# Altium project CC Programmer and Debugger.PrjPcb
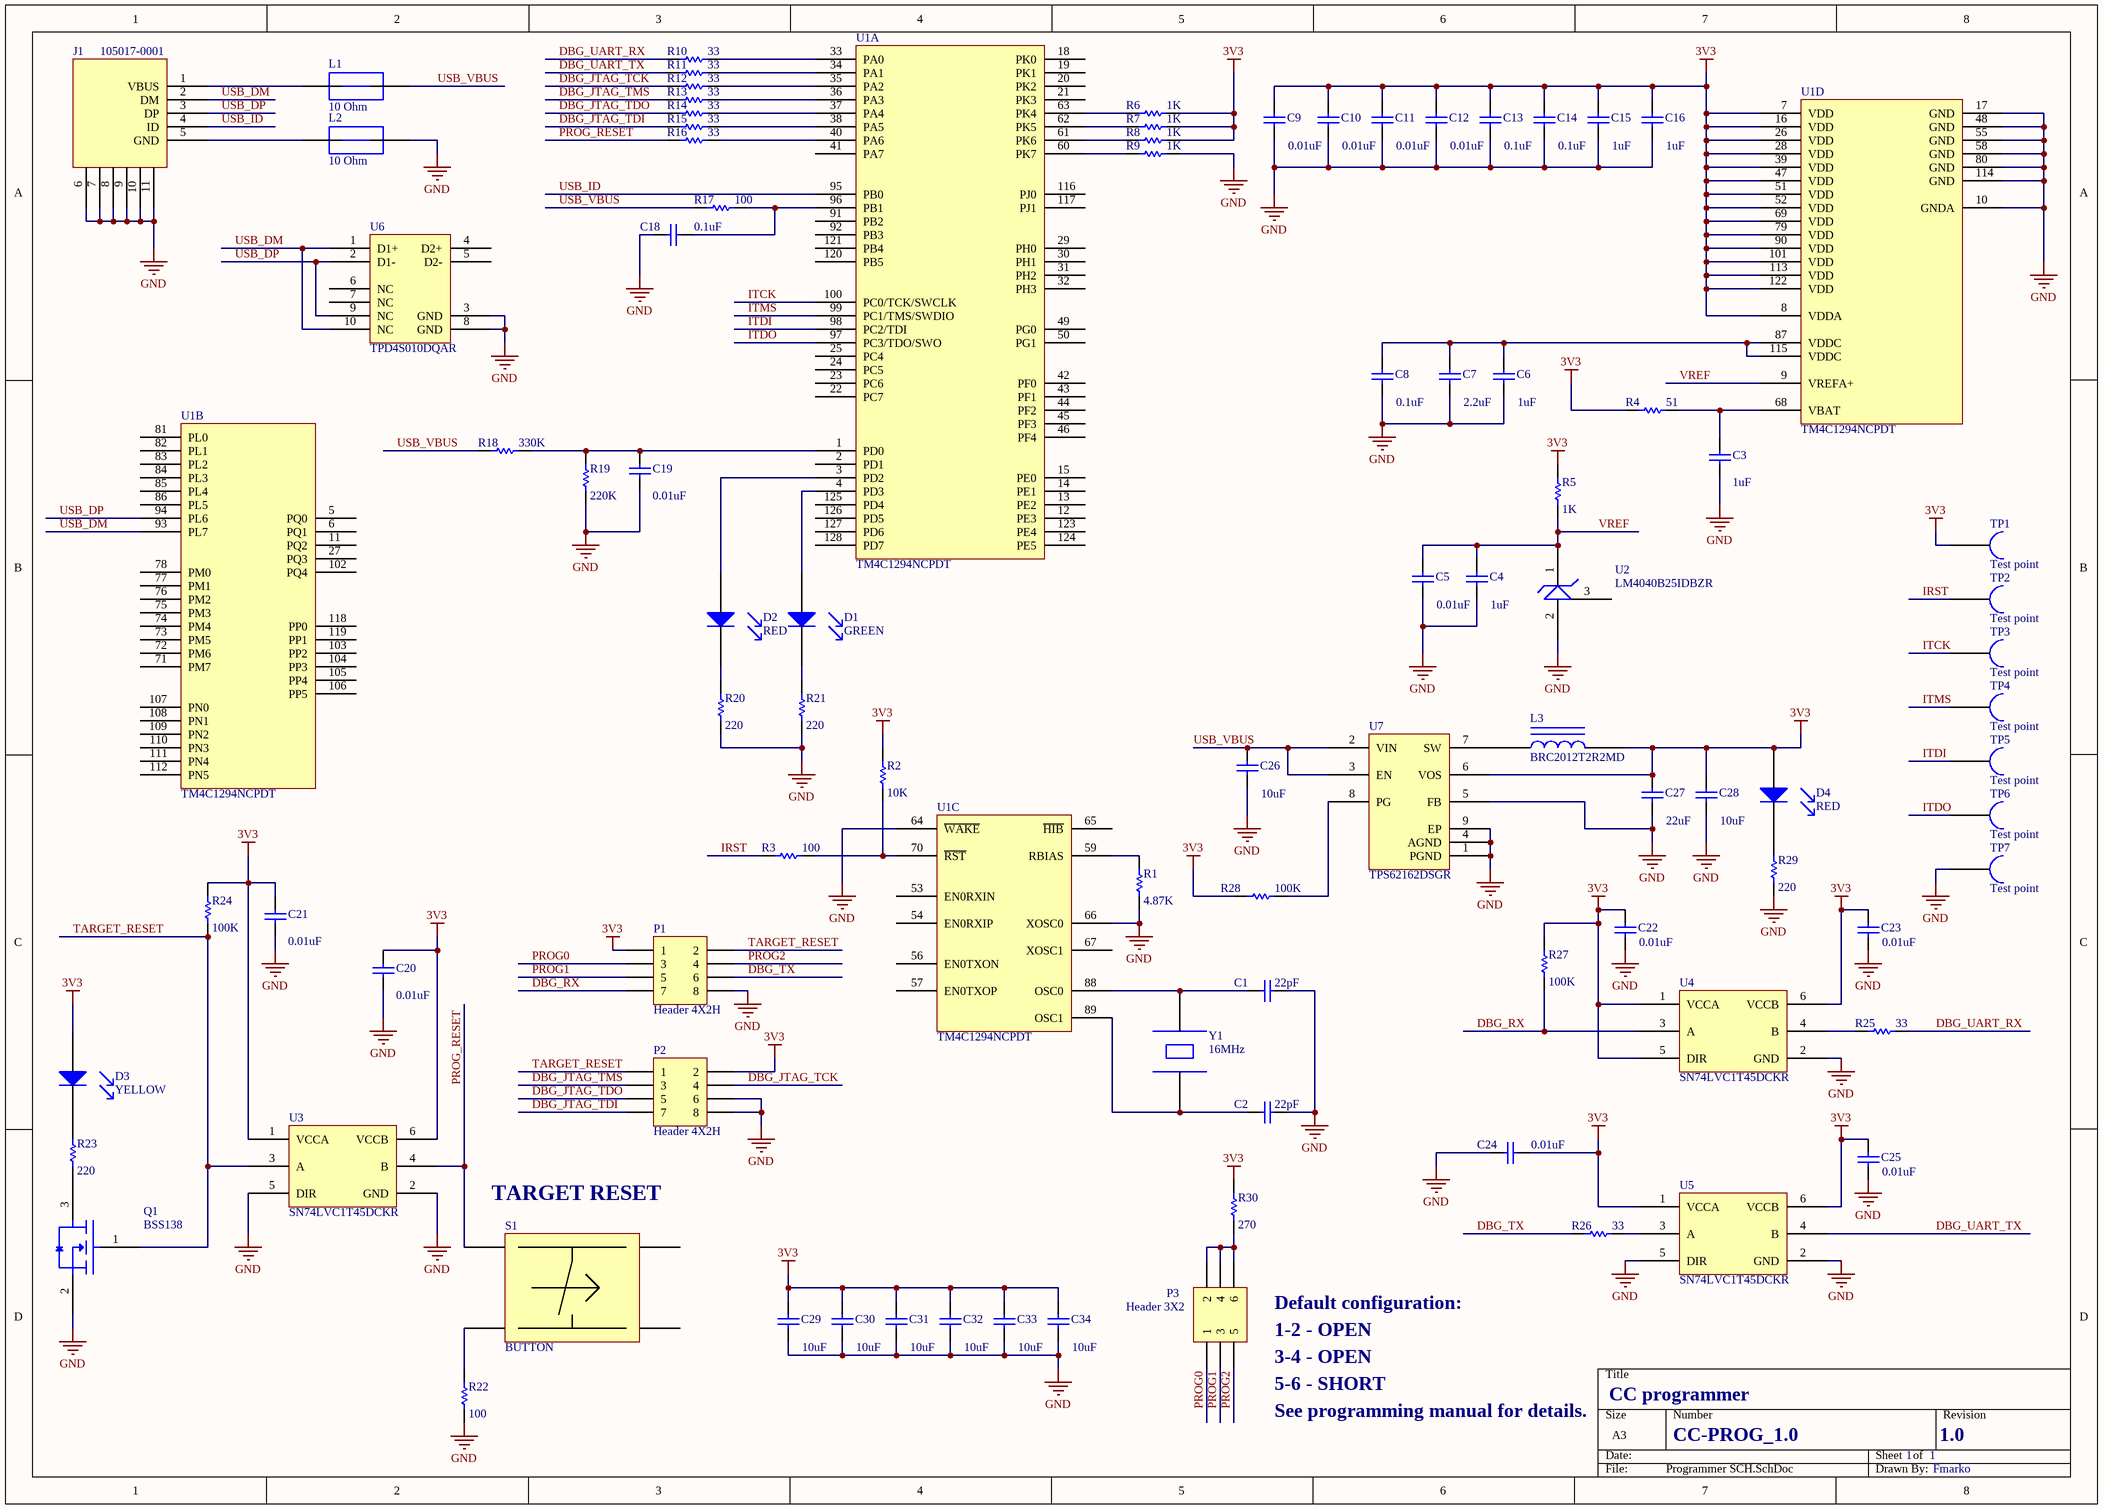
[diagram p0: Programmer SCH.SchDoc]
1 sheet, 91 parts. Net scope: global (net labels, ports and power ports of the same name join across sheets).
Board file: PCB.PcbDoc

## Sheet Programmer SCH.SchDoc
size A3

### Parts
C1  value 22pF  [1608[0603]]
C2  value 22pF  [1608[0603]]
C3  value 1uF  [1608[0603]]
C4  value 1uF  [1608[0603]]
C5  value 0.01uF  [1608[0603]]
C6  value 1uF  [1608[0603]]
C7  value 2.2uF  [1608[0603]]
C8  value 0.1uF  [1608[0603]]
C9  value 0.01uF  [1608[0603]]
C10  value 0.01uF  [1608[0603]]
C11  value 0.01uF  [1608[0603]]
C12  value 0.01uF  [1608[0603]]
C13  value 0.1uF  [1608[0603]]
C14  value 0.1uF  [1608[0603]]
C15  value 1uF  [1608[0603]]
C16  value 1uF  [1608[0603]]
C18  value 0.1uF  [1608[0603]]
C19  value 0.01uF  [1608[0603]]
C20  value 0.01uF  [1608[0603]]
C21  value 0.01uF  [1608[0603]]
C22  value 0.01uF  [1608[0603]]
C23  value 0.01uF  [1608[0603]]
C24  value 0.01uF  [1608[0603]]
C25  value 0.01uF  [1608[0603]]
C26  value 10uF  [1608[0603]]
C27  value 22uF  [1608[0603]]
C28  value 10uF  [1608[0603]]
C29  value 10uF  [C1206]
C30  value 10uF  [C1206]
C31  value 10uF  [C1206]
C32  value 10uF  [C1206]
C33  value 10uF  [C1206]
C34  value 10uF  [C1206]
D1  GREEN  [SODFL160X60-2N]
D2  RED  [SODFL160X80-2N]
D3  YELLOW  [SODFL160X80-2N]
D4  RED  [SODFL160X80-2N]
J1  105017-0001  [105017-0001]
L1  10 Ohm  [INDC1005X06N]
L2  10 Ohm  [INDC1005X06N]
L3  BRC2012T2R2MD  [INDC2012X10N]
P1  Header 4X2H  [HDR2X4H]
P2  Header 4X2H  [HDR2X4H]
P3  Header 3X2  [HDR2X3]
Q1  BSS138  [SOT95P315X120-3N]
R1  value 4.87K  [1608[0603]]
R2  value 10K  [1608[0603]]
R3  value 100  [1608[0603]]
R4  value 51  [1608[0603]]
R5  value 1K  [1608[0603]]
R6  value 1K  [1608[0603]]
R7  value 1K  [1608[0603]]
R8  value 1K  [1608[0603]]
R9  value 1K  [1608[0603]]
R10  value 33  [1608[0603]]
R11  value 33  [1608[0603]]
R12  value 33  [1608[0603]]
R13  value 33  [1608[0603]]
R14  value 33  [1608[0603]]
R15  value 33  [1608[0603]]
R16  value 33  [1608[0603]]
R17  value 100  [1608[0603]]
R18  value 330K  [1608[0603]]
R19  value 220K  [1608[0603]]
R20  value 220  [1608[0603]]
R21  value 220  [1608[0603]]
R22  value 100  [1608[0603]]
R23  value 220  [1608[0603]]
R24  value 100K  [1608[0603]]
R25  value 33  [1608[0603]]
R26  value 33  [1608[0603]]
R27  value 100K  [1608[0603]]
R28  value 100K  [1608[0603]]
R29  value 220  [1608[0603]]
R30  value 270  [1608[0603]]
S1  BUTTON  [PTS645SK43SMTR92LFS]
TP1  Test point  [Test_Point_1x1]
TP2  Test point  [Test_Point_1x1]
TP3  Test point  [Test_Point_1x1]
TP4  Test point  [Test_Point_1x1]
TP5  Test point  [Test_Point_1x1]
TP6  Test point  [Test_Point_1x1]
TP7  Test point  [Test_Point_1x1]
U1  TM4C1294NCPDT  [TSQFP40P1600X1600X120-128N]  (parts A,B,C,D of 4)
U2  LM4040B25IDBZR  [SOT95P237X112-3N]
U3  SN74LVC1T45DCKR  [TSOP65P210X110-6N]
U4  SN74LVC1T45DCKR  [TSOP65P210X110-6N]
U5  SN74LVC1T45DCKR  [TSOP65P210X110-6N]
U6  TPD4S010DQAR  [SON50P100X55-10N]
U7  TPS62162DSGR  [TPS62162DSGR]
Y1  16MHz  [ABM3-16.000MHZ-D2Y-T]

### Nets
3V3: C9.1 C10.1 C11.1 C12.1 C13.1 C14.1 C15.1 C16.1 C20.1 C21.1 C22.1 C23.1 C24.1 C25.1 C27.1 C28.1 C29.1 C30.1 C31.1 C32.1 C33.1 C34.1 D3.2(A) D4.2(A) L3.2 P1.1 P2.2 R2.2 R4.1 R5.2 R6.2 R7.2 R8.2 R24.2 R27.1 R28.2 R30.2 TP1.1 U1.7(VDD) U1.8(VDDA) U1.16(VDD) U1.26(VDD) U1.28(VDD) U1.39(VDD) U1.47(VDD) U1.51(VDD) U1.52(VDD) U1.69(VDD) U1.79(VDD) U1.90(VDD) U1.101(VDD) U1.113(VDD) U1.122(VDD) U3.1(VCCA) U3.6(VCCB) U4.1(VCCA) U4.5(DIR) U4.6(VCCB) U5.1(VCCA) U5.6(VCCB) U7.6(VOS)
GND: C1.2 C2.2 C3.2 C4.2 C5.2 C6.2 C7.2 C8.2 C9.2 C10.2 C11.2 C12.2 C13.2 C14.2 C15.2 C16.2 C18.2 C19.2 C20.2 C21.2 C22.2 C23.2 C24.2 C25.2 C26.2 C27.2 C28.2 C29.2 C30.2 C31.2 C32.2 C33.2 C34.2 J1.6 J1.7 J1.8 J1.9 J1.10 J1.11 L2.2 P1.8 P2.6 P2.8 Q1.2(S) R1.1 R9.2 R19.1 R20.1 R21.1 R22.1 R29.1 TP7.1 U1.10(GNDA) U1.17(GND) U1.48(GND) U1.55(GND) U1.58(GND) U1.64(~{WAKE}) U1.66(XOSC0) U1.80(GND) U1.114(GND) U2.2 U3.2(GND) U3.5(DIR) U4.2(GND) U5.2(GND) U5.5(DIR) U6.3(GND) U6.8(GND) U7.1(PGND) U7.4(AGND) U7.5(FB) U7.9(EP)
DBG_JTAG_TCK: P2.4 R12.1
DBG_JTAG_TDI: P2.7 R15.1
DBG_JTAG_TDO: P2.5 R14.1
DBG_JTAG_TMS: P2.3 R13.1
DBG_RX: P1.7 R27.2 U4.3(A)
DBG_TX: P1.6 R26.2
DBG_UART_RX: R10.1 R25.1
DBG_UART_TX: R11.1 U5.4(B)
IRST: R3.1 TP2.1
ITCK: TP3.1 U1.100(PC0/TCK/SWCLK)
ITDI: TP5.1 U1.98(PC2/TDI)
ITDO: TP6.1 U1.97(PC3/TDO/SWO)
ITMS: TP4.1 U1.99(PC1/TMS/SWDIO)
PROG0: P1.3 P3.1
PROG1: P1.5 P3.3
PROG2: P1.4 P3.5
PROG_RESET: R16.1 S1.1 U3.4(B)
TARGET_RESET: P1.2 P2.1 Q1.1(G) R24.1 U3.3(A)
USB_DM: J1.2(DM) U1.93(PL7) U6.1(D1+) U6.10(NC)
USB_DP: J1.3(DP) U1.94(PL6) U6.2(D1-) U6.9(NC)
USB_ID: J1.4(ID) U1.95(PB0)
USB_VBUS: C26.1 L1.2 R17.1 R18.1 U7.2(VIN) U7.3(EN)
VREF: C4.1 C5.1 R5.1 U1.9(VREFA+) U2.1
NetC1_1: C1.1 U1.88(OSC0) Y1.2
NetC2_1: C2.1 U1.89(OSC1) Y1.1
NetC3_1: C3.1 R4.2 U1.68(VBAT)
NetC6_1: C6.1 C7.1 C8.1 U1.87(VDDC) U1.115(VDDC)
NetC18_1: C18.1 R17.2 U1.96(PB1)
NetC19_1: C19.1 R18.2 R19.2 U1.1(PD0)
NetD1_1: D1.1(C) R21.2
NetD1_2: D1.2(A) U1.4(PD3)
NetD2_1: D2.1(C) R20.2
NetD2_2: D2.2(A) U1.3(PD2)
NetD3_1: D3.1(C) R23.2
NetD4_1: D4.1(C) R29.2
NetJ1_1: J1.1(VBUS) L1.1
NetJ1_5: J1.5(GND) L2.1
NetL3_1: L3.1 U7.7(SW)
NetP3_2: P3.2 P3.4 P3.6 R30.1
NetQ1_3: Q1.3(D) R23.1
NetR1_2: R1.2 U1.59(RBIAS)
NetR2_1: R2.1 R3.2 U1.70(~{RST})
NetR6_1: R6.1 U1.63(PK4)
NetR7_1: R7.1 U1.62(PK5)
NetR8_1: R8.1 U1.61(PK6)
NetR9_1: R9.1 U1.60(PK7)
NetR10_2: R10.2 U1.33(PA0)
NetR11_2: R11.2 U1.34(PA1)
NetR12_2: R12.2 U1.35(PA2)
NetR13_2: R13.2 U1.36(PA3)
NetR14_2: R14.2 U1.37(PA4)
NetR15_2: R15.2 U1.38(PA5)
NetR16_2: R16.2 U1.40(PA6)
NetR22_2: R22.2 S1.3
NetR25_2: R25.2 U4.4(B)
NetR26_1: R26.1 U5.3(A)
NetR28_1: R28.1 U7.8(PG)

Not connected (* = marked no-connect by the designer): S1 2 4; U1 2(PD1) 5(PQ0) 6(PQ1) 11(PQ2) 12(PE3) 13(PE2) 14(PE1) 15(PE0) 18(PK0) 19(PK1) 20(PK2) 21(PK3) 22(PC7) 23(PC6) 24(PC5) 25(PC4) 27(PQ3) 29(PH0) 30(PH1) 31(PH2) 32(PH3) 41(PA7) 42(PF0) 43(PF1) 44(PF2) 45(PF3) 46(PF4) 49(PG0) 50(PG1) 53(EN0RXIN) 54(EN0RXIP) 56(EN0TXON) 57(EN0TXOP) 65(~{HIB}) 67(XOSC1) 71(PM7) 72(PM6) 73(PM5) 74(PM4) 75(PM3) 76(PM2) 77(PM1) 78(PM0) 81(PL0) 82(PL1) 83(PL2) 84(PL3) 85(PL4) 86(PL5) 91(PB2) 92(PB3) 102(PQ4) 103(PP2) 104(PP3) 105(PP4) 106(PP5) 107(PN0) 108(PN1) 109(PN2) 110(PN3) 111(PN4) 112(PN5) 116(PJ0) 117(PJ1) 118(PP0) 119(PP1) 120(PB5) 121(PB4) 123(PE4) 124(PE5) 125(PD4) 126(PD5) 127(PD6) 128(PD7); U2 3; U6 4(D2+) 5(D2-) 6(NC) 7(NC)

### Notes on the sheet
- (near S1) TARGET RESET
- (near P3) Default configuration:
- (near P3) 1-2 - OPEN
- (near P3) 3-4 - OPEN
- (near P3) 5-6 - SHORT
- See programming manual for details.
- CC programmer
- CC-PROG_1.0
- 1
- 1.0
- Fmarko

### Library data of the parts
C1-C16 C18-C34 = Cap: Capacitor; Published: 8-Jun-2000; LatestRevisionDate: 17-Jul-2002; LatestRevisionNote: Re-released for DXP Platform.; PackageReference: RAD-0.3; Publisher: Altium Limited; PackageDescription: Radial Cap, Thru-Hole; 2 Leads; 0.3 in Pin Spacing
D1 = SML-LX0603GW-TR: SML-LX0603GW-TR Green LED, Lumex
D2 D4 = SML-311UTT86: SML-311UTT86, Red LED diode, ROHM
D3 = 150060YS75000: 150060YS75000 Yellow LED diode, Wurth
J1 = 105017-0001: Micro USB, B type, Molex
L1 L2 = BLM15AG100SN1D: BLM15AG100SN1D¸SMD filter Inductor, Murata
L3 = BRC2012T2R2MD: Wire-Wound chip power inductor, 2012(metric), Taiyo Yuden
P1 P2 = Header 4X2H: Header, 4-Pin, Dual row, Right Angle; LatestRevisionDate: 17-Jul-2002; LatestRevisionNote: Re-released for DXP Platform.; Publisher: Altium Limited
P3 = Header 3X2: Header, 3-Pin, Dual row; LatestRevisionDate: 17-Jul-2002; LatestRevisionNote: Re-released for DXP Platform.; Publisher: Altium Limited
Q1 = BSS138: , FAIRCHILD/ON SEMICONDUCTOR
R1-R30 = Res Semi: Semiconductor Resistor; Published: 8-Jun-2000; LatestRevisionDate: 17-Jul-2002; LatestRevisionNote: Re-released for DXP Platform.; PackageReference: AXIAL-0.5; Publisher: Altium Limited; PackageDescription: Axial Device, Thru-Hole; 2 Leads; 0.5 in Pin Spacing
S1 = PTS645SK43SMTR92LFS: PTS645SK43SMTR92LFS Tactile bushbutton, C&K Components
TP1-TP7 = TP1: PCB Test Point
U1 = TM4C1294NCPDT: TI Tiva C microcontroller, PQFN128
U2 = LM4040B25IDBZR: Precision micropower reference, TI
U3-U5 = SN74LVC1T45DCKR: Single-Bit Dual-Supply Bus Transceiver With Configurable Voltage  Translation and 3-State Outputs, TI
U6 = TPD4S010DQAR: USB ESD Solution, TI
U7 = x 3-V to 17-V, 1-A Step-Down Converters with DCS-Control: x 3-V to 17-V, 1-A Step-Down Converters with DCS-Control, TI
Y1 = ABM3-16.000MHZ-D2Y-T: Crystal 16 MHz, Abracon corporation